# Altium project HealthSensors.PrjPcb
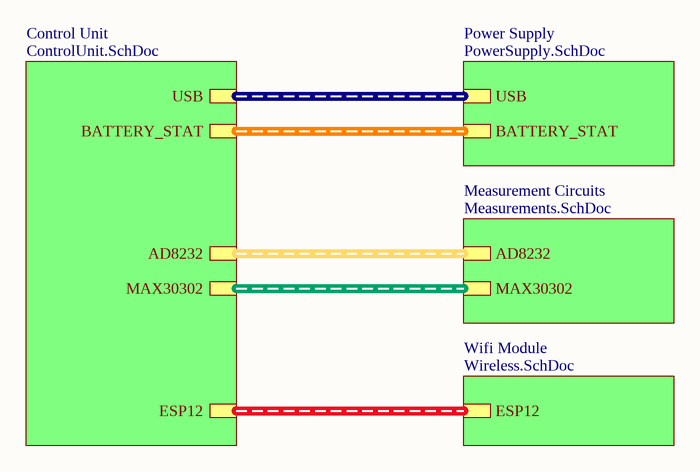
[diagram p0: HealthSensors.SchDoc]
5 sheets, 133 parts. Net scope: hierarchical (ports join the sheet entries above them; power ports are global).
Board file: HealthSensors.PcbDoc
Sheets:
  HealthSensors.SchDoc
    Control Unit = ControlUnit.SchDoc
    Power Supply = PowerSupply.SchDoc
    Measurement Circuits = Measurements.SchDoc
    Wifi Module = Wireless.SchDoc

## Sheet HealthSensors.SchDoc
size A

### Sub-sheets
Control Unit = ControlUnit.SchDoc: USB (harness Usb data), BATTERY_STAT (harness Battery info), ESP12 (harness Wifi connection), MAX30302 (harness MAX30302 circuit), AD8232 (harness AD8232 circuit)
Measurement Circuits = Measurements.SchDoc: MAX30302 (harness MAX30302 circuit), AD8232 (harness AD8232 circuit)
Power Supply = PowerSupply.SchDoc: USB (harness Usb data), BATTERY_STAT (harness Battery info)
Wifi Module = Wireless.SchDoc: ESP12 (harness Wifi connection)

### Buses and harness runs
harness sheet Control Unit/AD8232 = sheet Measurement Circuits/AD8232
harness sheet Control Unit/BATTERY_STAT = sheet Power Supply/BATTERY_STAT
harness sheet Control Unit/ESP12 = sheet Wifi Module/ESP12
harness sheet Control Unit/MAX30302 = sheet Measurement Circuits/MAX30302
harness sheet Control Unit/USB = sheet Power Supply/USB

## Sheet ControlUnit.SchDoc
size A4
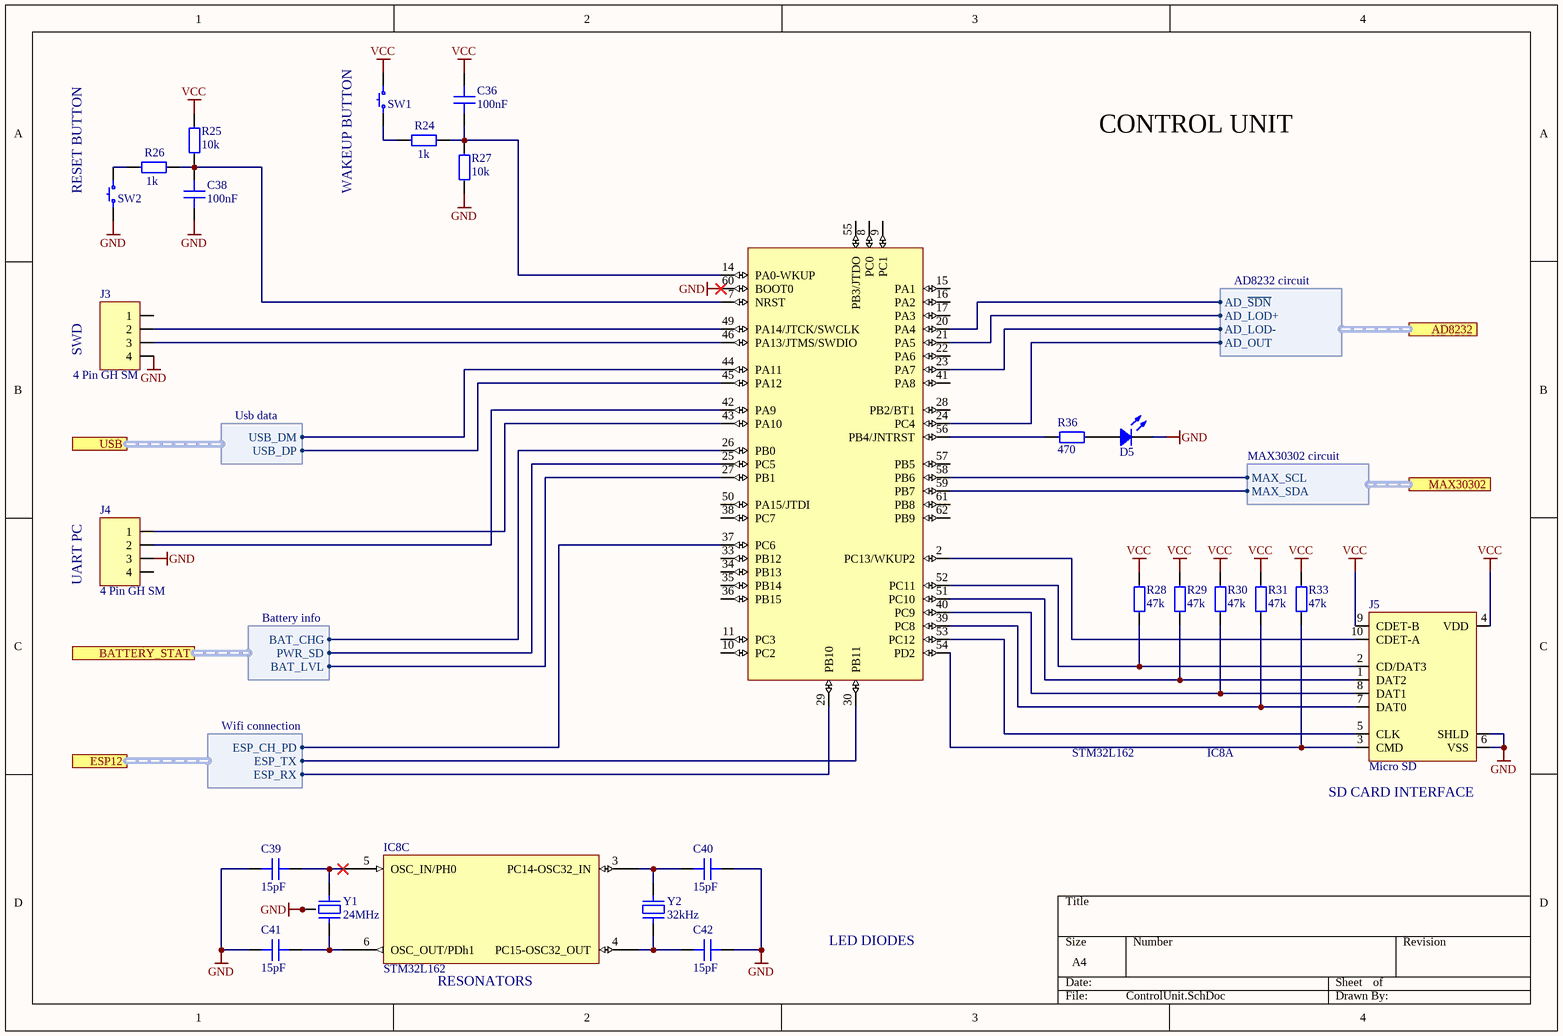
[diagram p1: ControlUnit.SchDoc]

### Parts
C36  100nF  [CAP 0603]
C38  100nF  [CAP 0603]
C39  15pF  [CAP 0603]
C40  15pF  [CAP 0603]
C41  15pF  [CAP 0603]
C42  15pF  [CAP 0603]
D5  Green  [LED 0603]  (value not drawn)
IC8  STM32L162  [LQFP64_L]  (parts A,C of 3)
J3  4 Pin GH SM  [SM04B]
J4  4 Pin GH SM  [SM04B]
J5  Micro SD  [HIROSE DM3AT-SF-PEJM5]
R24  1k  [RES 0603]
R25  10k  [RES 0603]
R26  1k  [RES 0603]
R27  10k  [RES 0603]
R28  47k  [RES 0603]
R29  47k  [RES 0603]
R30  47k  [RES 0603]
R31  47k  [RES 0603]
R33  47k  [RES 0603]
R36  470  [RES 0603]
SW1  BUTTON-NO  [SW OMRON]  (value not drawn)
SW2  BUTTON-NO  [SW OMRON]  (value not drawn)
Y1  24MHz  [RESONATOR ILCX13]
Y2  32kHz  [RESONATOR CFPX–217]

### Ports
AD8232 (harness AD8232 circuit), BATTERY_STAT (harness Battery info), ESP12 (harness Wifi connection), MAX30302 (harness MAX30302 circuit), USB (harness Usb data)

### Harnesses
Usb data: USB_DM, USB_DP
Battery info: BAT_LVL, PWR_SD, BAT_CHG
Wifi connection: ESP_CH_PD, ESP_TX, ESP_RX
MAX30302 circuit: MAX_SCL, MAX_SDA
AD8232 circuit: AD_~{SDN}, AD_LOD+, AD_LOD-, AD_OUT

### Nets
GND: C38.1 C39.1 C40.1 C41.1 C42.1 D5.2 IC8.60(BOOT0) J3.4 J4.3 J5.6(VSS) J5.S(SHLD) R27.1 SW2.2 Y1.2 Y1.4
VCC: C36.2 J5.4(VDD) J5.9(CDET-B) R25.2 R28.1 R29.1 R30.1 R31.1 R33.1 SW1.1
BAT_CHG: IC8.26(PB0) ; port BATTERY_STAT.BAT_CHG
BAT_LVL: IC8.27(PB1) ; port BATTERY_STAT.BAT_LVL
PWR_SD: IC8.25(PC5) ; port BATTERY_STAT.PWR_SD
USB_DM: IC8.44(PA11) ; port USB.USB_DM
USB_DP: IC8.45(PA12) ; port USB.USB_DP
NetC36_1: C36.1 IC8.14(PA0-WKUP) R24.1 R27.2
NetC38_2: C38.2 IC8.7(NRST) R25.1 R26.1
NetC39_2: C39.2 IC8.5(OSC_IN/PH0) Y1.1
NetC40_2: C40.2 IC8.3(PC14-OSC32_IN) Y2.2
NetC41_2: C41.2 IC8.6(OSC_OUT/PDh1) Y1.3
NetC42_2: C42.2 IC8.4(PC15-OSC32_OUT) Y2.1
NetC45_1: IC8.24(PC4) ; port AD8232.AD_OUT
NetD5_1: D5.1 R36.1
NetIC8_2: IC8.2(PC13/WKUP2) J5.10(CDET-A)
NetIC8_20: IC8.20(PA4) ; port AD8232.AD_~{SDN}
NetIC8_21: IC8.21(PA5) ; port AD8232.AD_LOD+
NetIC8_23: IC8.23(PA7) ; port AD8232.AD_LOD-
NetIC8_29: IC8.29(PB10) ; port ESP12.ESP_RX
NetIC8_30: IC8.30(PB11) ; port ESP12.ESP_TX
NetIC8_37: IC8.37(PC6) ; port ESP12.ESP_CH_PD
NetIC8_39: IC8.39(PC8) J5.7(DAT0) R31.2
NetIC8_40: IC8.40(PC9) J5.8(DAT1) R30.2
NetIC8_42: IC8.42(PA9) J4.2
NetIC8_43: IC8.43(PA10) J4.1
NetIC8_46: IC8.46(PA13/JTMS/SWDIO) J3.3
NetIC8_49: IC8.49(PA14/JTCK/SWCLK) J3.2
NetIC8_51: IC8.51(PC10) J5.1(DAT2) R29.2
NetIC8_52: IC8.52(PC11) J5.2(CD/DAT3) R28.2
NetIC8_53: IC8.53(PC12) J5.5(CLK)
NetIC8_54: IC8.54(PD2) J5.3(CMD) R33.2
NetIC8_56: IC8.56(PB4/JNTRST) R36.2
NetIC8_58: IC8.58(PB6) ; port MAX30302.MAX_SCL
NetIC8_59: IC8.59(PB7) ; port MAX30302.MAX_SDA
NetR24_2: R24.2 SW1.2
NetR26_2: R26.2 SW2.1

Not connected (* = marked no-connect by the designer): IC8 8(PC0) 9(PC1) 10(PC2) 11(PC3) 15(PA1) 16(PA2) 17(PA3) 22(PA6) 28(PB2/BT1) 33(PB12) 34(PB13) 35(PB14) 36(PB15) 38(PC7) 41(PA8) 50(PA15/JTDI) 55(PB3/JTDO) 57(PB5) 61(PB8) 62(PB9); J3 1; J4 4

### Notes on the sheet
- CONTROL UNIT
- (near SW2) RESET BUTTON
- (near SW1) WAKEUP BUTTON
- SWD
- UART PC
- (near J5) SD CARD INTERFACE
- (near IC8) RESONATORS
- LED DIODES

### Library data of the parts
C36 C38-C42 = Capacitor: SMT Capacitor
  C36 C38: Value: 100nF
  C39-C42: Value: 15pF
D5 = LED: Chip LED; Value: Green
IC8 = STM32L162: STM32 ARM-based 32-bit MCU with 32 Kbytes Flash, 64-pin LQFP; Value: STM32L162RDT; ComponentLink1Description: http://www.st.com/content/ccc/resource/technical/document/datasheet/ee/d5/84/2b/a9/ae/44/3d/DM00039232.pdf/files/DM00039232.pdf/jcr:content/translations/en.DM00039232.pdf; ComponentLink1URL: http://www.st.com/stonline/products/literature/ds/13586.pdf; Package: LQFP64
J3 J4 = 4 Pin GH SM: Złącze GH, męskie, poziome, 4 piny, SMD
J5 = Hirose DM3 MicroSD: Micro sd card slot
R24-R31 R33 R36 = Resistor: SMDResistor
  R24 R26: Value: 1k
  R25 R27: Value: 10k
  R28-R31 R33: Value: 47k
  R36: Value: 470
SW1 SW2 = BUTTON-NO 2 PIN Small: Button, SMD, Small, 2.5x3mm
Y1 = Resonator (4pin): Resonator
Y2 = Resonator

## Sheet PowerSupply.SchDoc
size A3
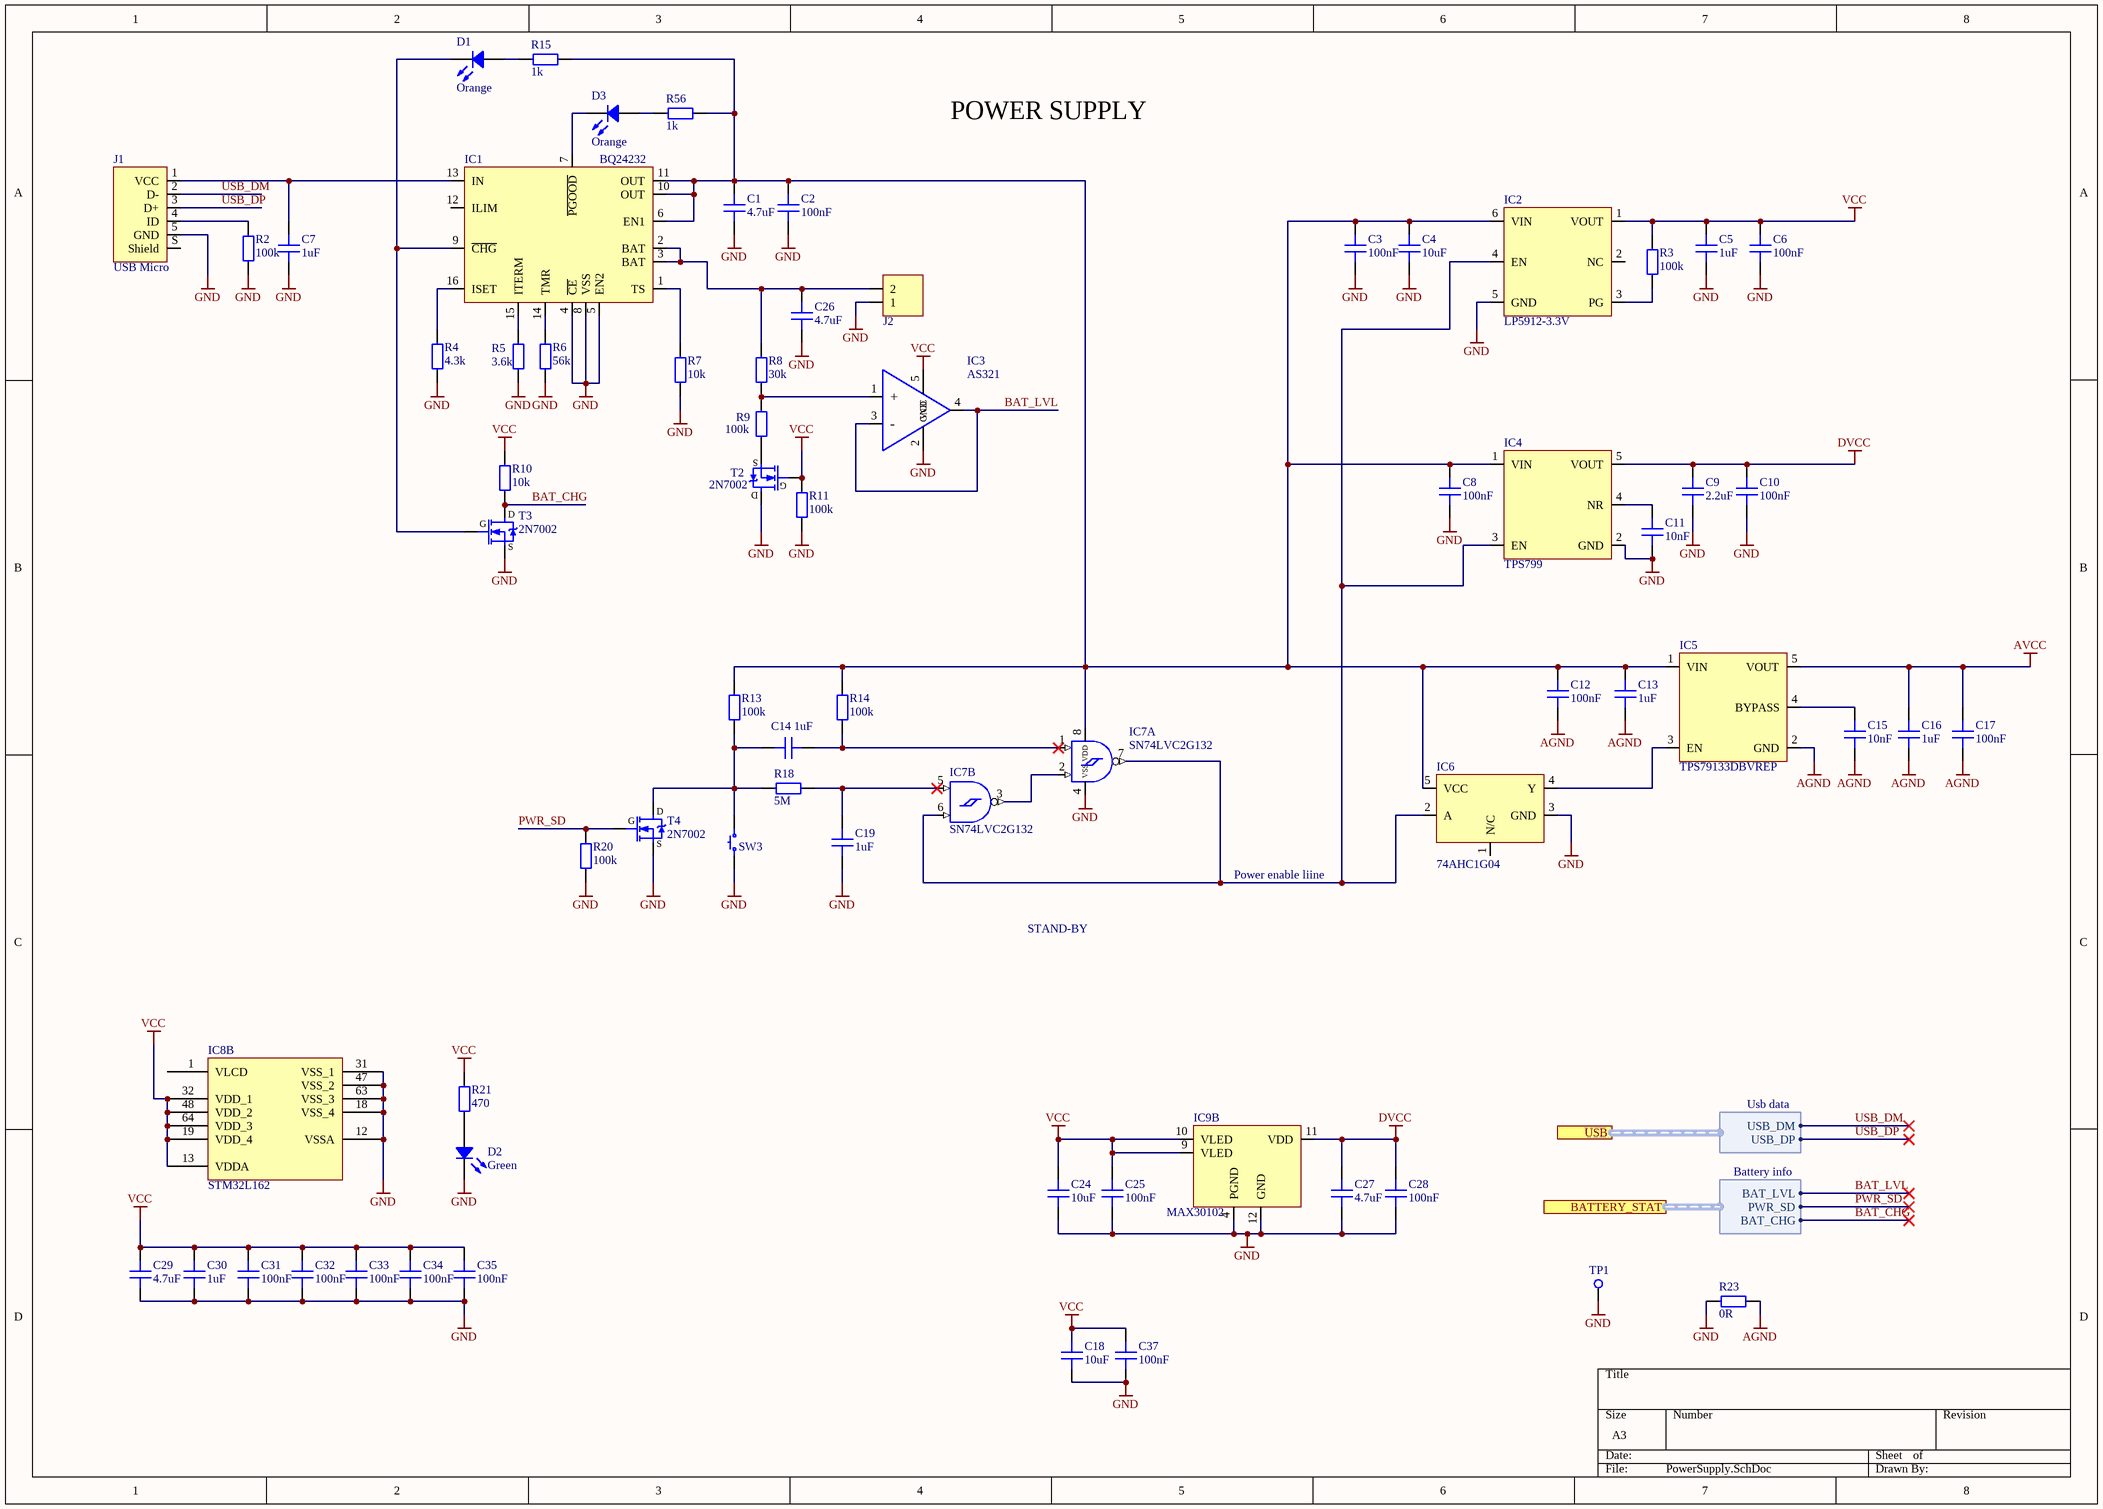
[diagram p2: PowerSupply.SchDoc]

### Parts
C1  4.7uF  [CAP 0603]
C2  100nF  [CAP 0603]
C3  100nF  [CAP 0603]
C4  10uF  [CAP 0603]
C5  1uF  [CAP 0603]
C6  100nF  [CAP 0603]
C7  1uF  [CAP 0603]
C8  100nF  [CAP 0603]
C9  2.2uF  [CAP 0603]
C10  100nF  [CAP 0603]
C11  10nF  [CAP 0603]
C12  100nF  [CAP 0603]
C13  1uF  [CAP 0603]
C14  1uF  [CAP 0603]
C15  10nF  [CAP 0603]
C16  1uF  [CAP 0603]
C17  100nF  [CAP 0603]
C18  10uF  [CAP 0603]
C19  1uF  [CAP 0603]
C24  10uF  [CAP 0603]
C25  100nF  [CAP 0603]
C26  4.7uF  [CAP 0603]
C27  4.7uF  [CAP 0603]
C28  100nF  [CAP 0603]
C29  4.7uF  [CAP 0603]
C30  1uF  [CAP 0603]
C31  100nF  [CAP 0603]
C32  100nF  [CAP 0603]
C33  100nF  [CAP 0603]
C34  100nF  [CAP 0603]
C35  100nF  [CAP 0603]
C37  100nF  [CAP 0603]
D1  Orange  [LED 0603]
D2  Green  [LED 0603]
D3  Orange  [LED 0603]
IC1  BQ24232  [QFN16]
IC2  LP5912-3.3V  [WSON 6]
IC3  AS321  [SOT23, 5-Leads]
IC4  TPS799  [SOT23, 5-Leads]
IC5  TPS79133DBVREP  [SOT23, 5-Leads]
IC6  74AHC1G04  [TSSOP5]
IC7  SN74LVC2G132  [TSSOP8]  (parts A,B of 2)
IC8  STM32L162  [LQFP64_L]  (part B of 3)
IC9  MAX30102  [MAX30102]  (part B of 2)
J1  USB Micro  [FCI USB 10118193-0001LF]
J2  2 pin  [HDR 1x2 2.54]  (value not drawn)
R2  100k  [RES 0603]
R3  100k  [RES 0603]
R4  4.3k  [RES 0603]
R5  3.6k  [RES 0603]
R6  56k  [RES 0603]
R7  10k  [RES 0603]
R8  30k  [RES 0603]
R9  100k  [RES 0603]
R10  10k  [RES 0603]
R11  100k  [RES 0603]
R13  100k  [RES 0603]
R14  100k  [RES 0603]
R15  1k  [RES 0603]
R18  5M  [RES 0603]
R20  100k  [RES 0603]
R21  470  [RES 0603]
R23  0R  [RES 0603]
R56  1k  [RES 0603]
SW3  BUTTON-NO  [SW OMRON]  (value not drawn)
T2  2N7002  [SOT23]
T3  2N7002  [SOT23]
T4  2N7002  [SOT23]
TP1  Test Point  [TP THT 48MILS]  (value not drawn)

### Ports
BATTERY_STAT (harness Battery info), USB (harness Usb data)

### Harnesses
Battery info: BAT_LVL, PWR_SD, BAT_CHG
Usb data: USB_DM, USB_DP

### Nets
AGND: C12.1 C13.1 C15.1 C16.1 C17.1 IC5.2(GND) R23.1
AVCC: C16.2 C17.2 IC5.5(VOUT)
DVCC: C9.2 C10.2 C27.2 C28.2 IC4.5(VOUT) IC9.11(VDD)
GND: C1.1 C2.1 C3.1 C4.1 C5.1 C6.1 C7.1 C8.1 C9.1 C10.1 C11.1 C18.1 C19.1 C24.1 C25.1 C26.1 C27.1 C28.1 C29.1 C30.1 C31.1 C32.1 C33.1 C34.1 C35.1 C37.1 D2.2 IC1.4(~{CE}) IC1.5(EN2) IC1.8(VSS) IC2.5(GND) IC3.2(GND) IC4.2(GND) IC6.3(GND) IC7.4(VSS) IC8.12(VSSA) IC8.18(VSS_4) IC8.31(VSS_1) IC8.47(VSS_2) IC8.63(VSS_3) IC9.4(PGND) IC9.12(GND) J1.5(GND) J2.1 R2.1 R4.1 R5.1 R6.1 R7.1 R11.1 R20.1 R23.2 SW3.2 T2.3(D) T3.2(S) T4.2(S) TP1.1(TP)
VCC: C5.2 C6.2 C18.2 C24.2 C25.2 C29.2 C30.2 C31.2 C32.2 C33.2 C34.2 C35.2 C37.2 IC2.1(VOUT) IC3.5(VCC) IC8.13(VDDA) IC8.19(VDD_4) IC8.32(VDD_1) IC8.48(VDD_2) IC8.64(VDD_3) IC9.9(VLED) IC9.10(VLED) R3.2 R10.2 R11.2 R21.2 T2.1(G)
BAT_CHG: R10.1 T3.3(D) ; port BATTERY_STAT.BAT_CHG
BAT_LVL: IC3.3(-) IC3.4(OUT) ; port BATTERY_STAT.BAT_LVL
PWR_SD: R20.2 T4.1(G) ; port BATTERY_STAT.PWR_SD
USB_DM: J1.2(D-) ; port USB.USB_DM
USB_DP: J1.3(D+) ; port USB.USB_DP
NetC1_2: C1.2 C2.2 C3.2 C4.2 C8.2 C12.2 C13.2 IC1.6(EN1) IC1.10(OUT) IC1.11(OUT) IC2.6(VIN) IC4.1(VIN) IC5.1(VIN) IC6.5(VCC) IC7.8(VDD) R13.2 R14.2 R15.1 R56.2
NetC7_2: C7.2 IC1.13(IN) J1.1(VCC)
NetC11_2: C11.2 IC4.4(NR)
NetC14_1: C14.1 R13.1 R18.2 SW3.1 T4.3(D)
NetC14_2: C14.2 IC7.1(A) R14.1
NetC15_2: C15.2 IC5.4(BYPASS)
NetC19_2: C19.2 IC7.5(A) R18.1
NetC26_2: C26.2 IC1.2(BAT) IC1.3(BAT) J2.2 R8.2
NetD1_1: D1.1 R15.2
NetD1_2: D1.2 IC1.9(~{CHG}) T3.1(G)
NetD2_1: D2.1 R21.1
NetD3_1: D3.1 R56.1
NetD3_2: D3.2 IC1.7(~{PGOOD})
NetIC1_1: IC1.1(TS) R7.2
NetIC1_14: IC1.14(TMR) R6.2
NetIC1_15: IC1.15(ITERM) R5.2
NetIC1_16: IC1.16(ISET) R4.2
NetIC2_3: IC2.3(PG) R3.1
NetIC2_4: IC2.4(EN) IC4.3(EN) IC6.2(A) IC7.6(B) IC7.7(Y)
NetIC3_1: IC3.1(+) R8.1 R9.2
NetIC5_3: IC5.3(EN) IC6.4(Y)
NetIC7_2: IC7.2(B) IC7.3(Y)
NetJ1_4: J1.4(ID) R2.2
NetR9_1: R9.1 T2.2(S)

Not connected (* = marked no-connect by the designer): IC1 12(ILIM); IC2 2(NC); IC6 1(N/C); IC8 1(VLCD); J1 S(Shield)

### Notes on the sheet
- POWER SUPPLY
- Power enable liine
- STAND-BY

### Library data of the parts
C1-C19 C24-C35 C37 = Capacitor: SMT Capacitor
  C1 C26 C27 C29: Value: 4.7uF
  C2 C3 C6 C8 C10 C12 C17 C25 C28 C31-C35 C37: Value: 100nF
  C4 C18 C24: Value: 10uF
  C5 C7 C13 C14 C16 C19 C30: Value: 1uF
  C9: Value: 2.2uF
  C11 C15: Value: 10nF
D1-D3 = LED: Chip LED
  D1 D3: Value: Orange
  D2: Value: Green
IC1 = TI BQ24232: USB Friendly 0.5A Li+ Charger w/ Dynamic Power Management
IC2 = TI LP5912-3.3V: 50 mA, 3 V TO 50 V, MICROPOWER, LOW-DROPOUT LINEAR REGULATOR
IC3 = AS321: Op amp
IC4 = TI TPS799: TPS799 200-mA, Low-Quiescent Current, Ultralow Noise, High-PSRR Low-Dropout Linear  Regulator
IC5 = TI TPS79133DBVREP: ULTRALOW NOISE, HIGH PSRR, FAST RF, 100-mA  LOW-DROPOUT LINEAR REGULATORS
IC6 = 74AHC1G04: Inverter
IC7 = SN74LVC2G132: Dual 2-Input NAND Gate With Schmitt-Trigger Inputs; Value: SN74LVC2G132
IC8 = STM32L162: as IC8 on sheet ControlUnit; ComponentLink1Description: http://www.st.com/content/ccc/resource/technical/document/datasheet/ee/d5/84/2b/a9/ae/44/3d/DM00039232.pdf/files/DM00039232.pdf/jcr:content/translations/en.DM00039232.pdf; ComponentLink1URL: http://www.st.com/stonline/products/literature/ds/13586.pdf; Package: LQFP64
IC9 = MAX30102: Pulse Oximeter and Heart-Rate Sensor
J1 = USB 2.0 Type B Micro: Micro usb
J2 = 2 pin: 2 pin header, male
R2-R11 R13-R15 R18 R20 R21 R23 R56 = Resistor: SMDResistor
  R2 R3 R9 R11 R13 R14 R20: Value: 100k
  R4: Value: 4.3k
  R5: Value: 3.6k
  R6: Value: 56k
  R7 R10: Value: 10k
  R8: Value: 30k
  R15 R56: Value: 1k
  R18: Value: 5M
  R21: Value: 470
  R23: Value: 0R
SW3 = BUTTON-NO 2 PIN Small: Button, SMD, Small, 2.5x3mm
T2-T4 = N-MOSFET: Unipolar transistor N-MOSFET; Value: 2N7002

## Sheet Measurements.SchDoc: Measurement circuits
size A3; Author: Kajetan Śpionek
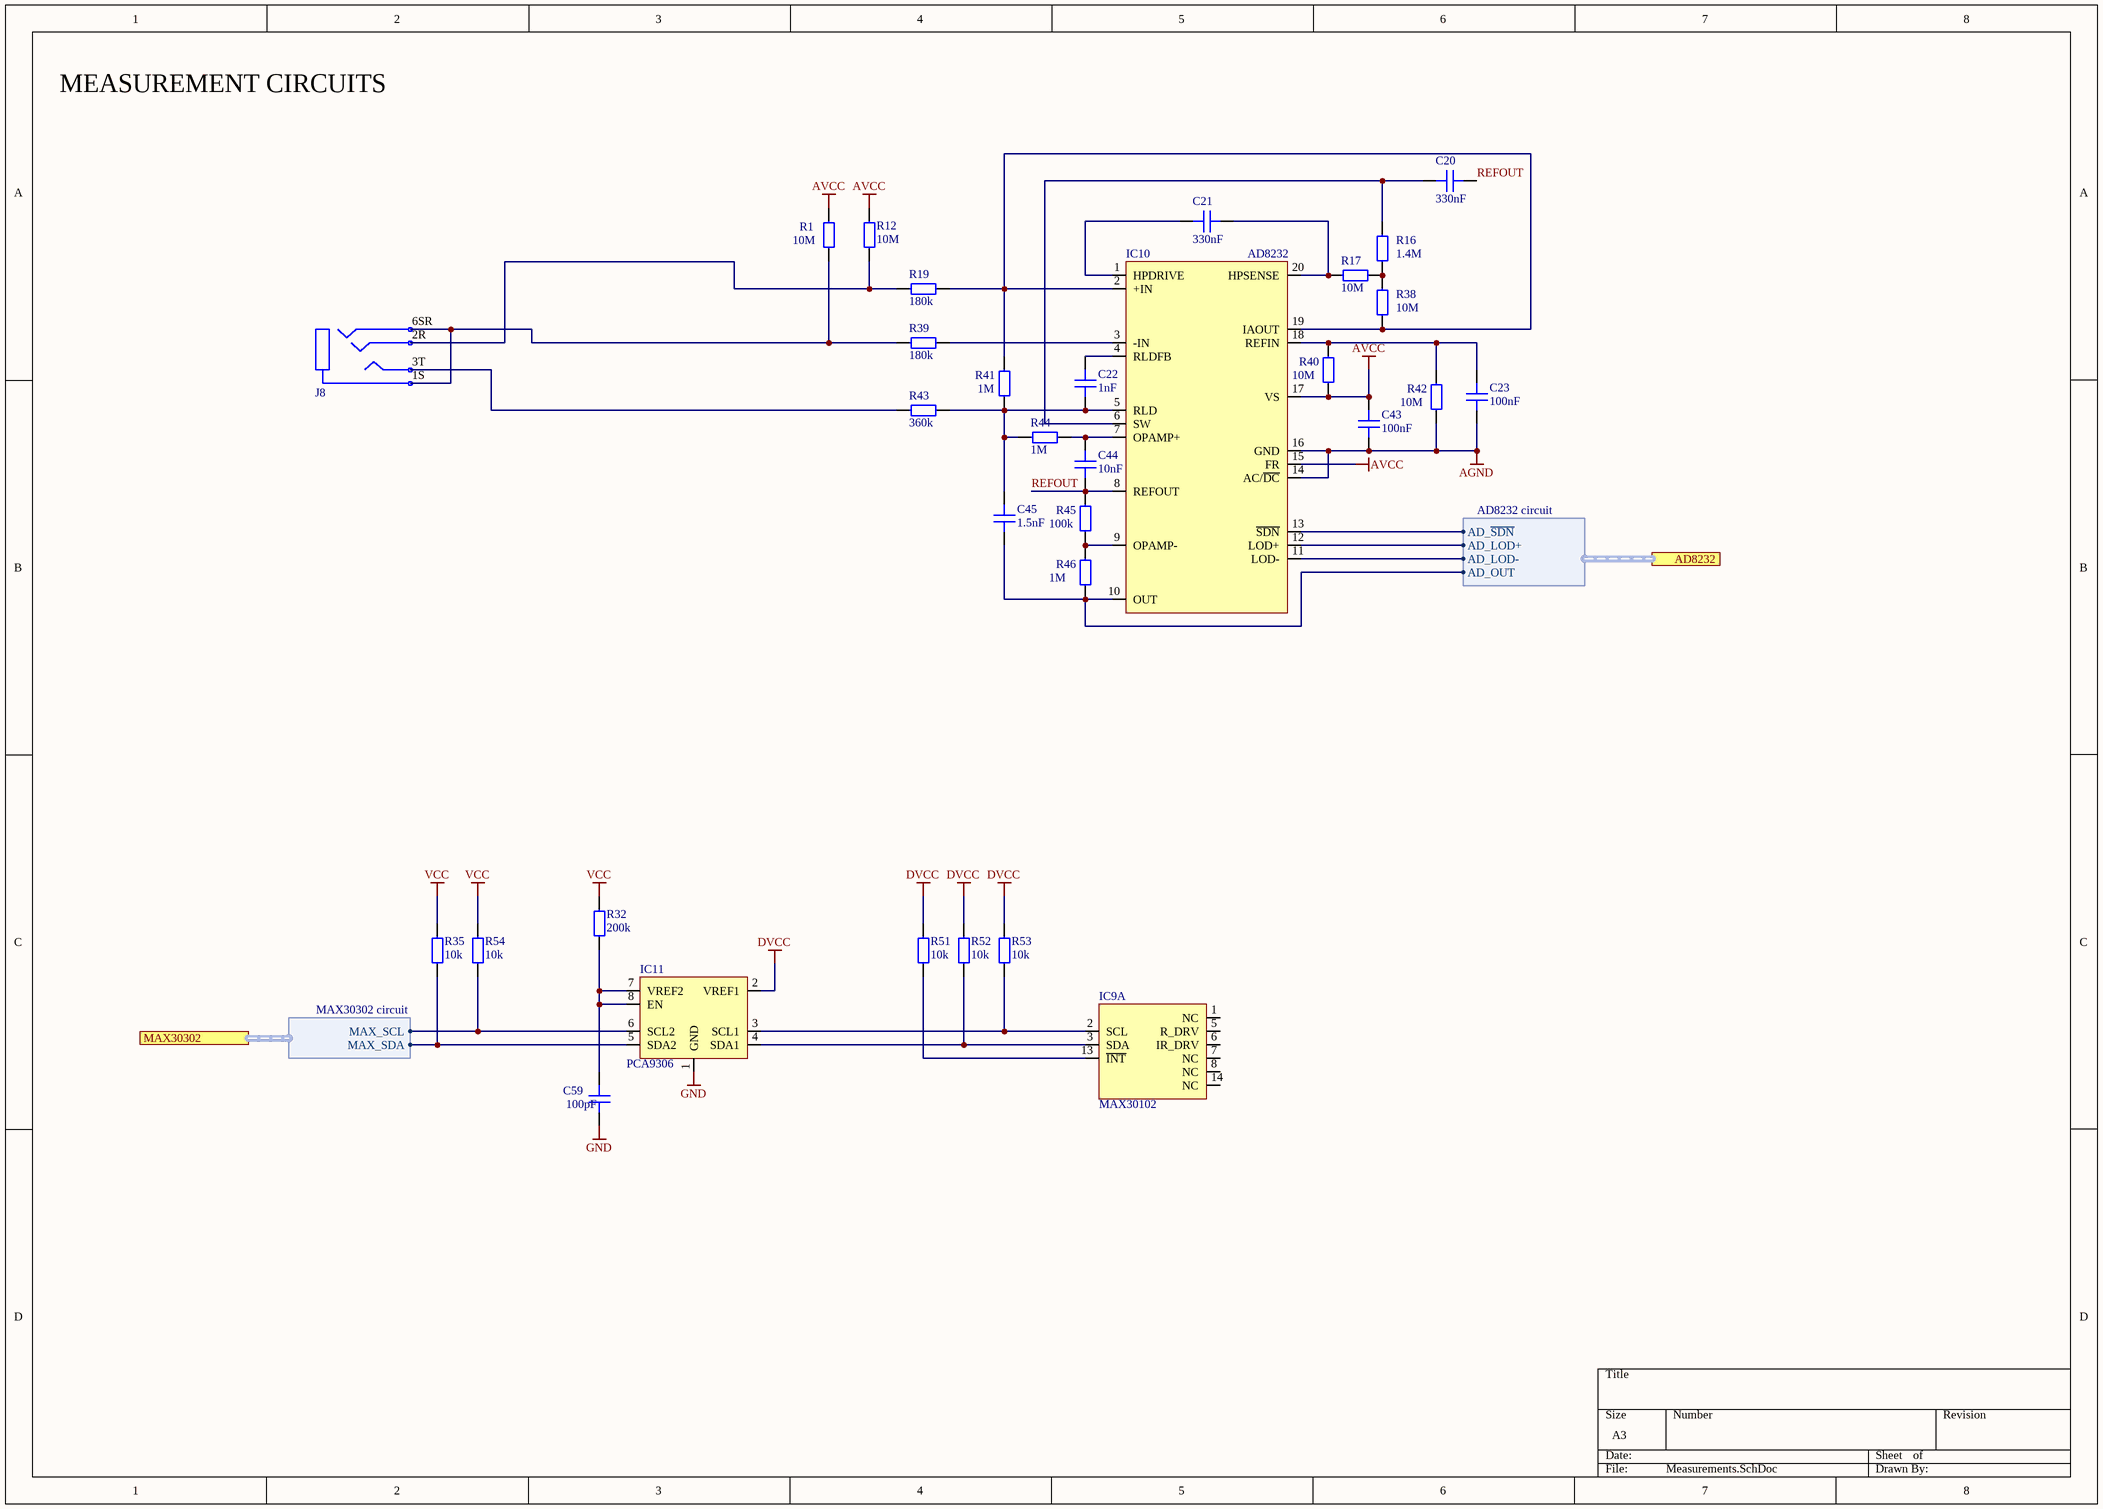
[diagram p3: Measurements.SchDoc]

### Parts
C20  330nF  [CAP 0603]
C21  330nF  [CAP 0603]
C22  1nF  [CAP 0603]
C23  100nF  [CAP 0603]
C43  100nF  [CAP 0603]
C44  10nF  [CAP 0603]
C45  1.5nF  [CAP 0603]
C59  100pF  [CAP 0603]
IC9  MAX30102  [MAX30102]  (part A of 2)
IC10  AD8232  [LFCSP 20]
IC11  PCA9306  [SSOP8]
J8  4 pin  [CLIFF FC68126]  (value not drawn)
R1  10M  [RES 0603]
R12  10M  [RES 0603]
R16  1.4M  [RES 0603]
R17  10M  [RES 0603]
R19  180k  [RES 0603]
R32  200k  [RES 0603]
R35  10k  [RES 0603]
R38  10M  [RES 0603]
R39  180k  [RES 0603]
R40  10M  [RES 0603]
R41  1M  [RES 0603]
R42  10M  [RES 0603]
R43  360k  [RES 0603]
R44  1M  [RES 0603]
R45  100k  [RES 0603]
R46  1M  [RES 0603]
R51  10k  [RES 0603]
R52  10k  [RES 0603]
R53  10k  [RES 0603]
R54  10k  [RES 0603]

### Ports
AD8232 (harness AD8232 circuit), MAX30302 (harness MAX30302 circuit)

### Harnesses
MAX30302 circuit: MAX_SCL, MAX_SDA
AD8232 circuit: AD_~{SDN}, AD_LOD+, AD_LOD-, AD_OUT

### Nets
AGND: C23.1 C43.1 IC10.14(AC/~{DC}) IC10.16(GND) R42.1
AVCC: C43.2 IC10.15(FR) IC10.17(VS) R1.2 R12.1 R40.1
DVCC: IC11.2(VREF1) R51.2 R52.2 R53.2
GND: C59.1 IC11.1(GND)
VCC: R32.2 R35.2 R54.2
REFOUT: C20.1 C44.1 IC10.8(REFOUT) R45.2
NetC20_2: C20.2 IC10.6(SW) R16.2
NetC21_1: C21.1 IC10.20(HPSENSE) R17.2
NetC21_2: C21.2 IC10.1(HPDRIVE)
NetC22_1: C22.1 C45.2 IC10.5(RLD) R41.1 R43.1 R44.2
NetC22_2: C22.2 IC10.4(RLDFB)
NetC23_2: C23.2 IC10.18(REFIN) R40.2 R42.2
NetC44_2: C44.2 IC10.7(OPAMP+) R44.1
NetC45_1: C45.1 IC10.10(OUT) R46.1 ; port AD8232.AD_OUT
NetC59_2: C59.2 IC11.7(VREF2) IC11.8(EN) R32.1
NetIC8_20: IC10.13(~{SDN}) ; port AD8232.AD_~{SDN}
NetIC8_21: IC10.12(LOD+) ; port AD8232.AD_LOD+
NetIC8_23: IC10.11(LOD-) ; port AD8232.AD_LOD-
NetIC8_58: IC11.6(SCL2) R54.1 ; port MAX30302.MAX_SCL
NetIC8_59: IC11.5(SDA2) R35.1 ; port MAX30302.MAX_SDA
NetIC9_2: IC9.2(SCL) IC11.3(SCL1) R53.1
NetIC9_3: IC9.3(SDA) IC11.4(SDA1) R52.1
NetIC9_13: IC9.13(~{INT}) R51.1
NetIC10_2: IC10.2(+IN) IC10.19(IAOUT) R19.1 R38.1 R41.2
NetIC10_3: IC10.3(-IN) R39.1
NetIC10_9: IC10.9(OPAMP-) R45.1 R46.2
NetJ8_1S: J8.1S J8.6SR R1.1 R39.2
NetJ8_2R: J8.2R R12.2 R19.2
NetJ8_3T: J8.3T R43.2
NetR16_1: R16.1 R17.1 R38.2

Not connected (* = marked no-connect by the designer): IC9 1(NC) 5(R_DRV) 6(IR_DRV) 7(NC) 8(NC) 14(NC)

### Notes on the sheet
- MEASUREMENT CIRCUITS

### Library data of the parts
C20-C23 C43-C45 C59 = Capacitor: SMT Capacitor
  C20 C21: Value: 330nF
  C22: Value: 1nF
  C23 C43: Value: 100nF
  C44: Value: 10nF
  C45: Value: 1.5nF
  C59: Value: 100pF
IC9 = MAX30102: Pulse Oximeter and Heart-Rate Sensor
IC10 = AD8232: Single-Lead, Heart Rate Monitor Front End
IC11 = PCA9306: Dual Bidirectional I2C Bus and SMBus Voltage-Level Translator
J8 = CLIFF FC68127 3.5mm: Jack 3,5mm, dock, female
R1 R12 R16 R17 R19 R32 R35 R38-R46 R51-R54 = Resistor: SMDResistor
  R1 R12 R17 R38 R40 R42: Value: 10M
  R16: Value: 1.4M
  R19 R39: Value: 180k
  R32: Value: 200k
  R35 R51-R54: Value: 10k
  R41 R44 R46: Value: 1M
  R43: Value: 360k
  R45: Value: 100k

## Sheet Wireless.SchDoc
size A
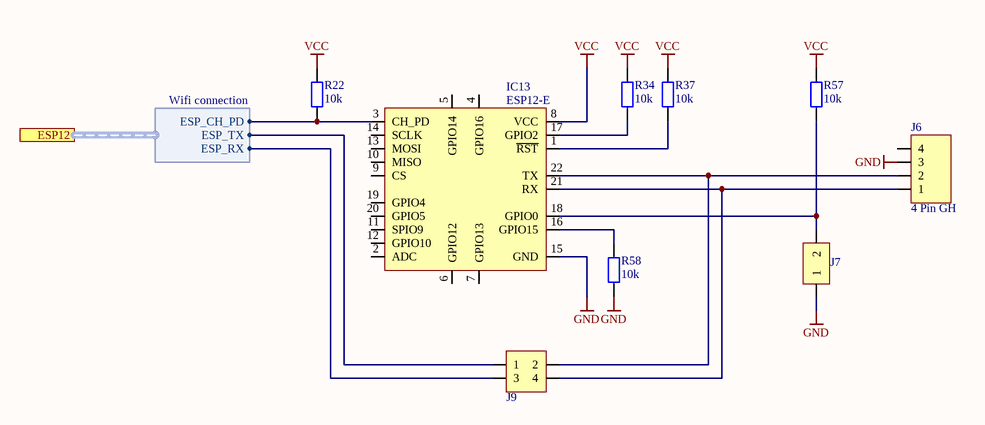
[diagram p4: Wireless.SchDoc]

### Parts
IC13  ESP12-E  [ESP8266 ESP-12-E]
J6  4 Pin GH  [BM04B]
J7  2 pin  [Harwin vertical smt header - single]  (value not drawn)
J9  4 pin  [Harwin vertical smt header - double]  (value not drawn)
R22  10k  [RES 0603]
R34  10k  [RES 0603]
R37  10k  [RES 0603]
R57  10k  [RES 0603]
R58  10k  [RES 0603]

### Ports
ESP12 (harness Wifi connection)

### Harnesses
Wifi connection: ESP_CH_PD, ESP_TX, ESP_RX

### Nets
GND: IC13.15(GND) J6.3 J7.1 R58.1
VCC: IC13.8(VCC) R22.2 R34.2 R37.2 R57.2
NetIC8_29: J9.3 ; port ESP12.ESP_RX
NetIC8_30: J9.1 ; port ESP12.ESP_TX
NetIC8_37: IC13.3(CH_PD) R22.1 ; port ESP12.ESP_CH_PD
NetIC13_1: IC13.1(~{RST}) R37.1
NetIC13_16: IC13.16(GPIO15) R58.2
NetIC13_17: IC13.17(GPIO2) R34.1
NetIC13_18: IC13.18(GPIO0) J7.2 R57.1
NetIC13_21: IC13.21(RX) J6.1 J9.4
NetIC13_22: IC13.22(TX) J6.2 J9.2

Not connected (* = marked no-connect by the designer): IC13 2(ADC) 4(GPIO16) 5(GPIO14) 6(GPIO12) 7(GPIO13) 9(CS) 10(MISO) 11(SPIO9) 12(GPIO10) 13(MOSI) 14(SCLK) 19(GPIO4) 20(GPIO5); J6 4

### Library data of the parts
IC13 = ESP-12E: Wifi module, esp12-e, based on ESP8266 chip
J6 = 4 Pin GH: Złącze GH, męskie, proste, 4 piny, SMD
J7 = harvin vertical smt header - single: 2 pin vertical connection smt harvin
J9 = harvin vertical smt header - double: 4 pin vertical connection smt harvin
R22 R34 R37 R57 R58 = Resistor: SMDResistor; Value: 10k

## Nets that join several sheets
AGND: PowerSupply (7 pins), Measurements (5 pins)
AVCC: PowerSupply (C16.2 C17.2 IC5.5), Measurements (6 pins)
DVCC: PowerSupply (6 pins), Measurements (IC11.2 R51.2 R52.2 R53.2)
GND: ControlUnit (15 pins), PowerSupply (57 pins), Measurements (C59.1 IC11.1), Wireless (IC13.15 J6.3 J7.1 R58.1)
VCC: ControlUnit (10 pins), PowerSupply (27 pins), Measurements (R32.2 R35.2 R54.2), Wireless (5 pins)
BAT_CHG: ControlUnit (IC8.26), PowerSupply (R10.1 T3.3)
BAT_LVL: ControlUnit (IC8.27), PowerSupply (IC3.3 IC3.4)
NetC45_1: ControlUnit (IC8.24), Measurements (C45.1 IC10.10 R46.1)
NetIC8_20: ControlUnit (IC8.20), Measurements (IC10.13)
NetIC8_21: ControlUnit (IC8.21), Measurements (IC10.12)
NetIC8_23: ControlUnit (IC8.23), Measurements (IC10.11)
NetIC8_29: ControlUnit (IC8.29), Wireless (J9.3)
NetIC8_30: ControlUnit (IC8.30), Wireless (J9.1)
NetIC8_37: ControlUnit (IC8.37), Wireless (IC13.3 R22.1)
NetIC8_58: ControlUnit (IC8.58), Measurements (IC11.6 R54.1)
NetIC8_59: ControlUnit (IC8.59), Measurements (IC11.5 R35.1)
PWR_SD: ControlUnit (IC8.25), PowerSupply (R20.2 T4.1)
USB_DM: ControlUnit (IC8.44), PowerSupply (J1.2)
USB_DP: ControlUnit (IC8.45), PowerSupply (J1.3)